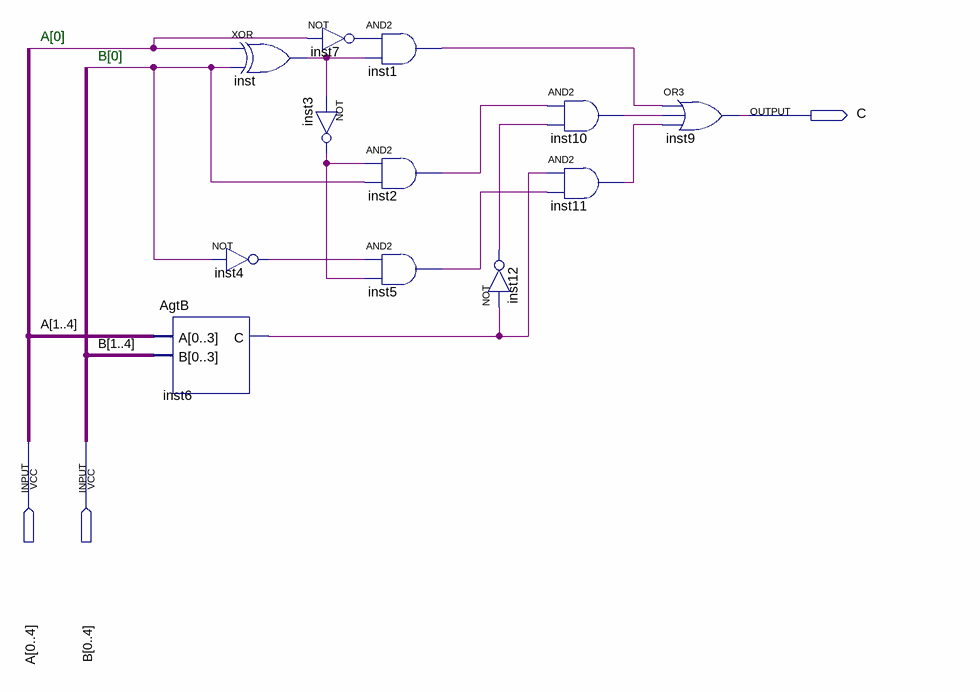
[diagram p0: schematic sheet]
// Quartus schematic maior.bdf as structural Verilog: 12 symbols, 3 pins
module maior (
  input  [0:4] A,
  input  [0:4] B,
  output C
);

  wire inst1_out, inst2_out, inst3_out, inst4_out, inst5_out, inst6_c, inst7_out, inst10_out, inst11_out,
       inst12_out, inst_out;

  AgtB inst6 (.A(A[1:4]), .B(B[1:4]), .C(inst6_c));
  xor inst (inst_out, A[0], B[0]);
  not inst4 (inst4_out, B[0]);
  not inst7 (inst7_out, A[0]);
  not inst3 (inst3_out, inst_out);
  and inst1 (inst1_out, inst7_out, inst_out);
  and inst2 (inst2_out, inst3_out, B[0]);
  and inst5 (inst5_out, inst4_out, inst3_out);
  not inst12 (inst12_out, inst6_c);
  and inst10 (inst10_out, inst2_out, inst12_out);
  and inst11 (inst11_out, inst6_c, inst5_out);
  or inst9 (C, inst1_out, inst10_out, inst11_out);

  // Notes on the sheet:
  //   A[0]
  //   B[0]
endmodule
